# EAGLE design cdf-teensy-interrupter-v2 (EAGLE 7.3.0)
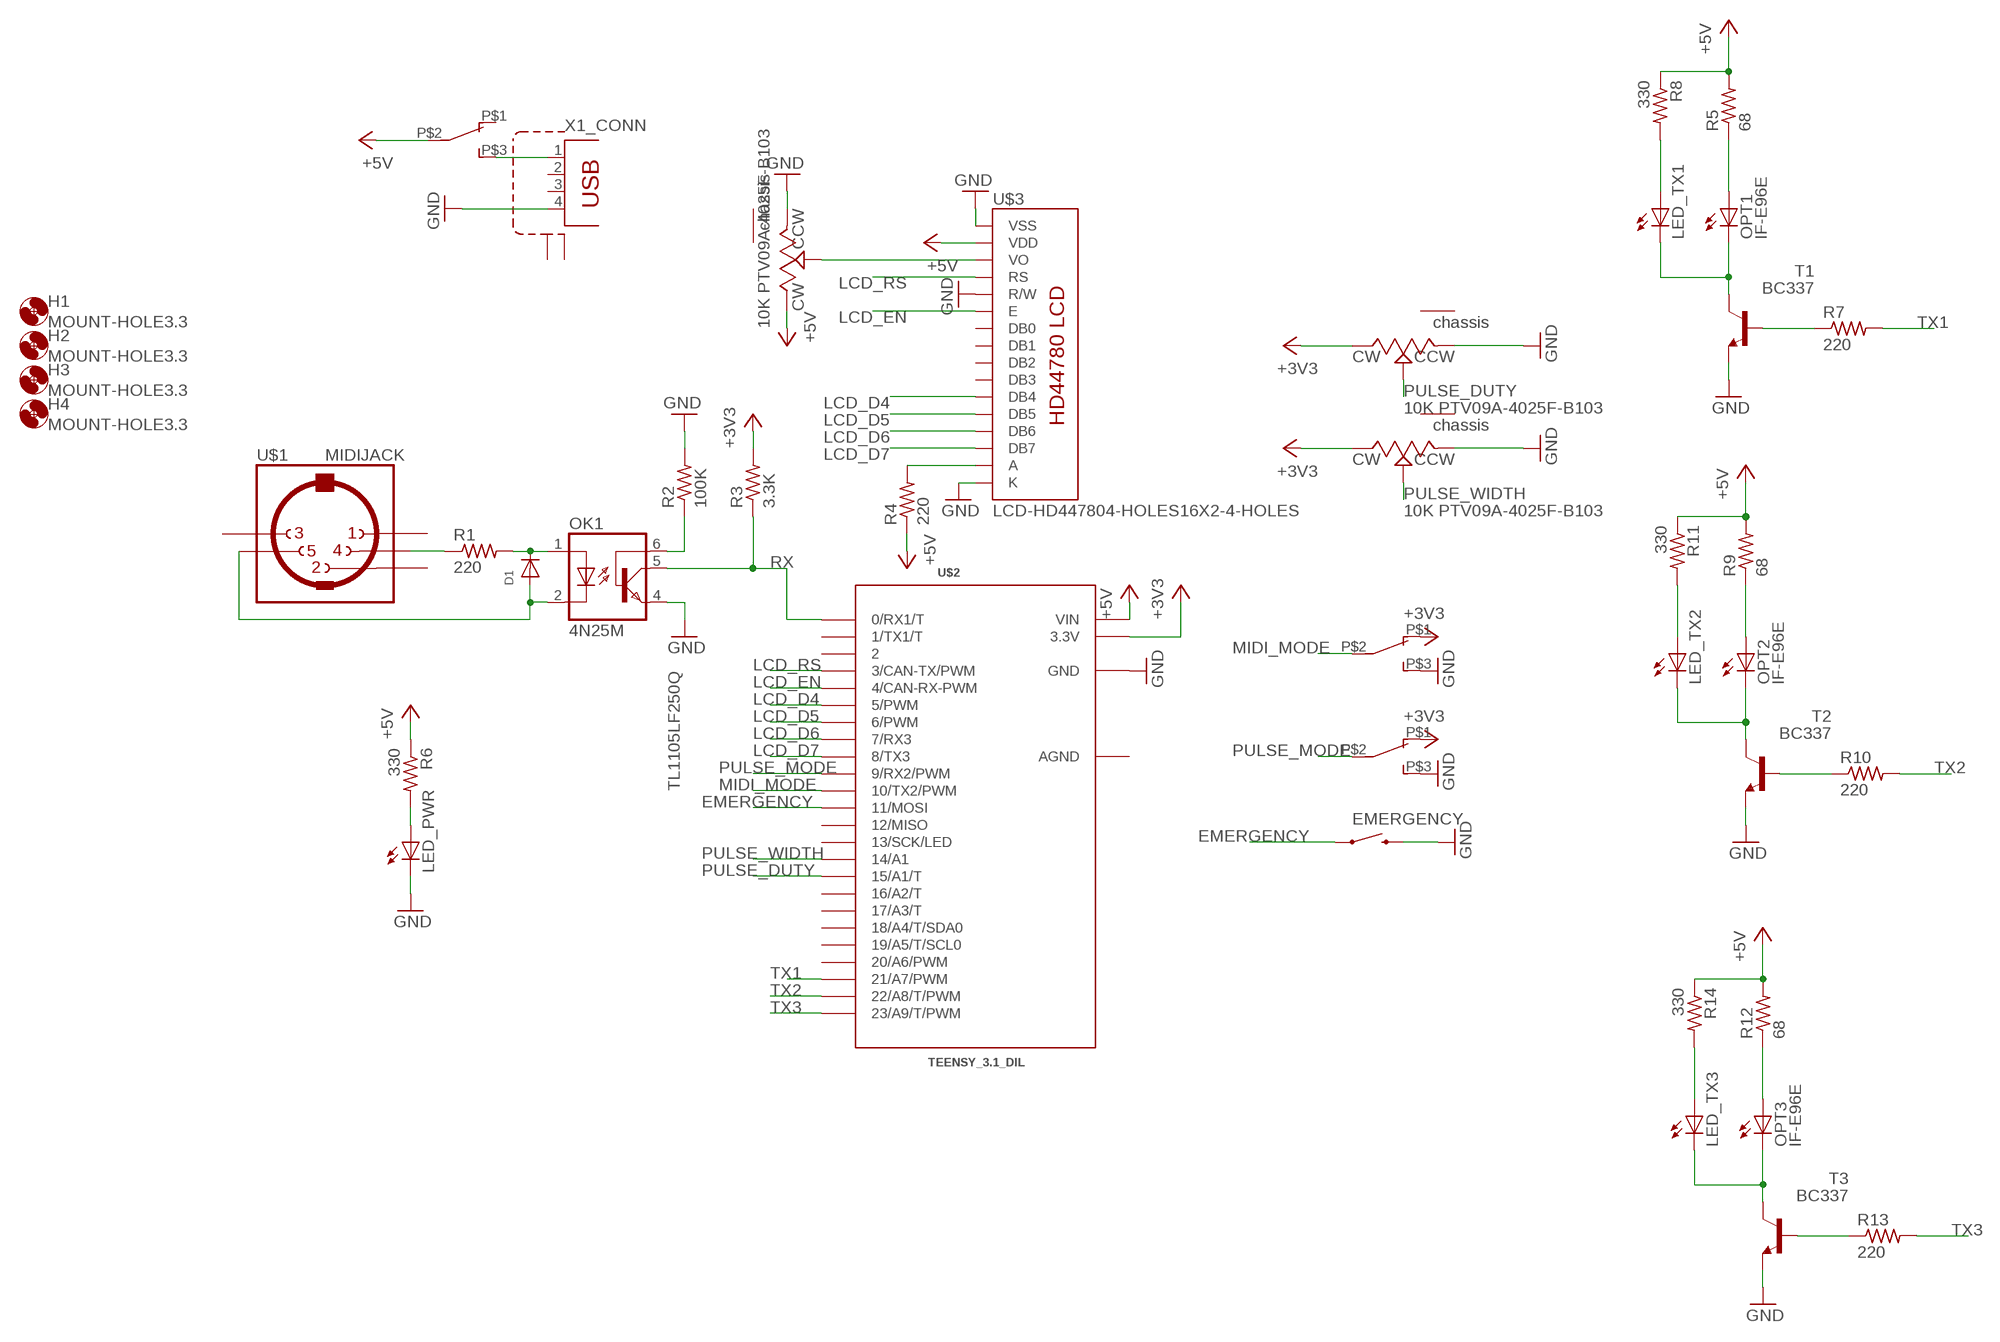
[diagram p0: schematic, sheet 1]

## Parts
D1  DIODEDO-1N4148  [DO-1N4148]
EMERGENCY  TL1105LF250Q  SWITCH-MOMENTARY-2PTH  [TACTILE-PTH]
H1  MOUNT-HOLE3.3  [3,3]
H2  MOUNT-HOLE3.3  [3,3]
H3  MOUNT-HOLE3.3  [3,3]
H4  MOUNT-HOLE3.3  [3,3]
LCD_BL  10K PTV09A-4025F-B103  POTENTIOMETERPTV09A_VERTICAL  [PTV09A-4]
LED_PWR  LED5MM  [LED5MM]
LED_TX1  LED5MM  [LED5MM]
LED_TX2  LED5MM  [LED5MM]
LED_TX3  LED5MM  [LED5MM]
MIDI  100SP1T1B4M2QE  [100SP1T1B4M2QE]
OK1  4N25M  [DIL06]
OPT1  IF-E96E  [IF-E96E]
OPT2  IF-E96E  [IF-E96E]
OPT3  IF-E96E  [IF-E96E]
PULSE  100SP1T1B4M2QE  [100SP1T1B4M2QE]
PULSE_DUTY  10K PTV09A-4025F-B103  POTENTIOMETERPTV09A_VERTICAL  [PTV09A-4]
PULSE_WIDTH  10K PTV09A-4025F-B103  POTENTIOMETERPTV09A_VERTICAL  [PTV09A-4]
PWR_SW  100SP1T1B4M2QE  [100SP1T1B4M2QE]
R1  220  R-US_0204/7  [0204/7]
R2  100K  R-US_0204/7  [0204/7]
R3  3.3K  R-US_0204/7  [0204/7]
R4  220  R-US_0204/7  [0204/7]
R5  68  R-US_0204/7  [0204/7]
R6  330  R-US_0204/7  [0204/7]
R7  220  R-US_0204/7  [0204/7]
R8  330  R-US_0204/7  [0204/7]
R9  68  R-US_0204/7  [0204/7]
R10  220  R-US_0204/7  [0204/7]
R11  330  R-US_0204/7  [0204/7]
R12  68  R-US_0204/7  [0204/7]
R13  220  R-US_0204/7  [0204/7]
R14  330  R-US_0204/7  [0204/7]
T1  BC337  [TO92]
T2  BC337  [TO92]
T3  BC337  [TO92]
U$1  MIDIJACK  [CP-2350]
U$2  TEENSY_3.1_DIL  [TEENSY3-DIL]
U$3  LCD-HD447804-HOLES16X2-4-HOLES  [LCD-16X2-4HOLES]
X1  TE-292304-1  [TE-292304-1]

## Nets
+3V3: MIDI.P$1 PULSE.P$1 PULSE_DUTY.3(CW) PULSE_WIDTH.3(CW) R3.2 U$2.3.3V
+5V: LCD_BL.3(CW) PWR_SW.P$2 R4.1 R5.2 R6.1 R8.1 R9.2 R11.1 R12.2 R14.1 U$2.VIN U$3.2(VDD)
EMERGENCY: EMERGENCY.1 U$2.11(11/MOSI)
GND: EMERGENCY.3 LCD_BL.1(CCW) LED_PWR.K(C) MIDI.P$3 OK1.4(EMI) PULSE.P$3 PULSE_DUTY.1(CCW) PULSE_WIDTH.1(CCW) R2.2 T1.1(E) T2.1(E) T3.1(E) U$2.GND U$3.1(VSS) U$3.5(R/W) U$3.16(K) X1.4
LCD_D4: U$2.5(5/PWM) U$3.11(DB4)
LCD_D5: U$2.6(6/PWM) U$3.12(DB5)
LCD_D6: U$2.7(7/RX3) U$3.13(DB6)
LCD_D7: U$2.8(8/TX3) U$3.14(DB7)
LCD_EN: U$2.4(4/CAN-RX-PWM) U$3.6(E)
LCD_RS: U$2.3(3/CAN-TX/PWM) U$3.4(RS)
MIDI_MODE: MIDI.P$2 U$2.10(10/TX2/PWM)
N$1: R1.1 U$1.4
N$2: D1.C OK1.1(A) R1.2
N$3: D1.A OK1.2(C) U$1.5
N$4: OK1.6(BAS) R2.1
N$5: LCD_BL.2(WIPER) U$3.3(VO)
N$6: R4.2 U$3.15(A)
N$7: R7.1 T1.2(B)
N$8: OPT1.P$2_ANODE+(A) R5.1
N$9: LED_PWR.A R6.2
N$10: LED_TX1.A R8.2
N$11: LED_TX1.K(C) OPT1.P$1_CATHODE-(C) T1.3(C)
N$12: OPT2.P$2_ANODE+(A) R9.1
N$13: R10.1 T2.2(B)
N$14: LED_TX2.K(C) OPT2.P$1_CATHODE-(C) T2.3(C)
N$15: LED_TX2.A R11.2
N$16: OPT3.P$2_ANODE+(A) R12.1
N$17: R13.1 T3.2(B)
N$18: LED_TX3.K(C) OPT3.P$1_CATHODE-(C) T3.3(C)
N$19: LED_TX3.A R14.2
N$20: PWR_SW.P$3 X1.1
PULSE_DUTY: PULSE_DUTY.2(WIPER) U$2.15/A1(15/A1/T)
PULSE_MODE: PULSE.P$2 U$2.9(9/RX2/PWM)
PULSE_WIDTH: PULSE_WIDTH.2(WIPER) U$2.14/A0(14/A1)
RX: OK1.5(COL) R3.1 U$2.0(0/RX1/T)
TX1: R7.2 U$2.21/A7(21/A7/PWM)
TX2: R10.2 U$2.22/A8(22/A8/T/PWM)
TX3: R13.2 U$2.23/A9(23/A9/T/PWM)
Unconnected: LCD_BL.4(CHASSIS) PULSE_DUTY.4(CHASSIS) PULSE_WIDTH.4(CHASSIS) PWR_SW.P$1 U$1.1 U$1.2 U$1.3 U$2.1(1/TX1/T) U$2.2 U$2.12(12/MISO) U$2.13(13/SCK/LED) U$2.16/A2(16/A2/T) U$2.17/A3(17/A3/T) U$2.18/A4(18/A4/T/SDA0) U$2.19/A5(19/A5/T/SCL0) U$2.20/A6(20/A6/PWM) U$3.7(DB0) U$3.8(DB1) U$3.9(DB2) U$3.10(DB3) X1.2 X1.3 X1.P$1(SHIELD:S1) X1.P$2(SHIELD:S2)

## Notes on the sheet
- TL1105LF250Q

## Power pins joined to a net without a drawn wire
AGND: U$2.AGND

## Library data of the parts
D1 = adafruit:DIODE: Diode SMADIODE - SMA Surface Mount Package 20V 1A Schottky Diode Digikey: 641-1014-6-ND DO-1N4148 - Through Hole Small Current Diode SOD-123 20V 1 A (.5mV Vf) Schottky Diode - Digikey: MBRX120TPMSCT-ND SOD-323 10V 570mA (.38mV Vf, 3ns) Schottky Diode - Digikey: ZLLS410CT-ND SOD-523 30V 30mA Schottky Diode (RB751S-40TE61) - Digikey: RB751S-40TE61CT-ND SOT23-R/W - SOT23 Package (R = Solder Paste/Reflow Ovens, W = Hand-Soldering) BAT54Film 40V 300mA - Digikey: 497-7162-1-ND
EMERGENCY = SparkFun-Electromechanical:SWITCH-MOMENTARY-2: Various NO switches- pushbuttons, reed, etc; PROD_ID: SWCH-08441
H1-H4 = holes:MOUNT-HOLE: MOUNTING HOLE with drill center marker
LCD_BL PULSE_DUTY PULSE_WIDTH = Bourns:POTENTIOMETER
LED_PWR LED_TX1-LED_TX3 = adafruit:LED: LED OSRAM: - CHIPLED LG R971, LG N971, LY N971, LG Q971, LY Q971, LO R971, LY R971 LH N974, LH R974 LS Q976, LO Q976, LY Q976 LO Q996 - Hyper CHIPLED LW Q18S LB Q993, LB Q99A, LB R99A - SideLED LS A670, LO A670, LY A670, LG A670, LP A670 LB A673, LV A673, LT A673, LW A673 LH A674 LY A675 LS A676, LA A676, LO A676, LY A676, LW A676 LS A679, LY A679, LG A679 - Hyper Micro SIDELED® LS Y876, LA Y876, LO Y876, LY Y876 LT Y87S - SmartLED LW L88C, LW L88S LB L89C, LB L89S, LG L890 LS L89K, LO L89K, LY L89K LS L896, LA L896, LO L896, LY L896 - TOPLED LS T670, LO T670, LY T670, LG T670, LP T670 LSG T670, LSP T670, LSY T670, LOP T670, LYG T670 LG T671, LOG T671, LSG T671 LB T673, LV T673, LT T673, LW T673 LH T674 LS T676, LA T676, LO T676, LY T676, LB T676, LH T676, LSB T676, LW T676 LB T67C, LV T67C, LT T67C, LS T67K, LO T67K, LY T67K, LW E67C LS E67B, LA E67B, LO E67B, LY E67B, LB E67C, LV E67C, LT E67C LW T67C LS T679, LY T679, LG T679 LS T770, LO T770, LY T770, LG T770, LP T770 LB T773, LV T773, LT T773, LW T773 LH T774 LS E675, LA E675, LY E675, LS T675 LS T776, LA T776, LO T776, LY T776, LB T776 LHGB T686 LT T68C, LB T68C - Hyper Mini TOPLED® LB M676 - Mini TOPLED Santana® LG M470 LS M47K, LO M47K, LY M47K Source: http://www.osram.convergy.de/
MIDI PULSE PWR_SW = keves:100SP1T1B4M2QE: 100SP1T1B4M2QE SPDT SWITCH
OK1 = optocoupler:4N*?M: General Purpose 6-Pin Phototransistor Optocouplers Source: http://www.fairchildsemi.com/ds/4N/4N35-M.pdf; MPN: 4N25-M; OC_FARNELL: 1021349; OC_NEWARK: 98K9084
OPT1-OPT3 = keves:IF-E96E
R1-R14 = rcl:R-US_: RESISTOR, American symbol
T1-T3 = transistor:BC337: NPN TRANSISTOR
U$1 = keves:MIDIJACK: DIN 5 jack also known as MIDI jack A modification of conn-hirshman:MAB5SH with two options for the grounding 'teeth'
U$2 = Teensy_3_and_LC_Series_Boards_v1.1:TEENSY_3.1_DIL: Teensy 3.1 or 3.2 in a DIL Layout.
U$3 = HD44780LCD:LCD-HD44780
X1 = keves:TE-292304-1: USB A Female connector; MPN: 292304-1

## Board
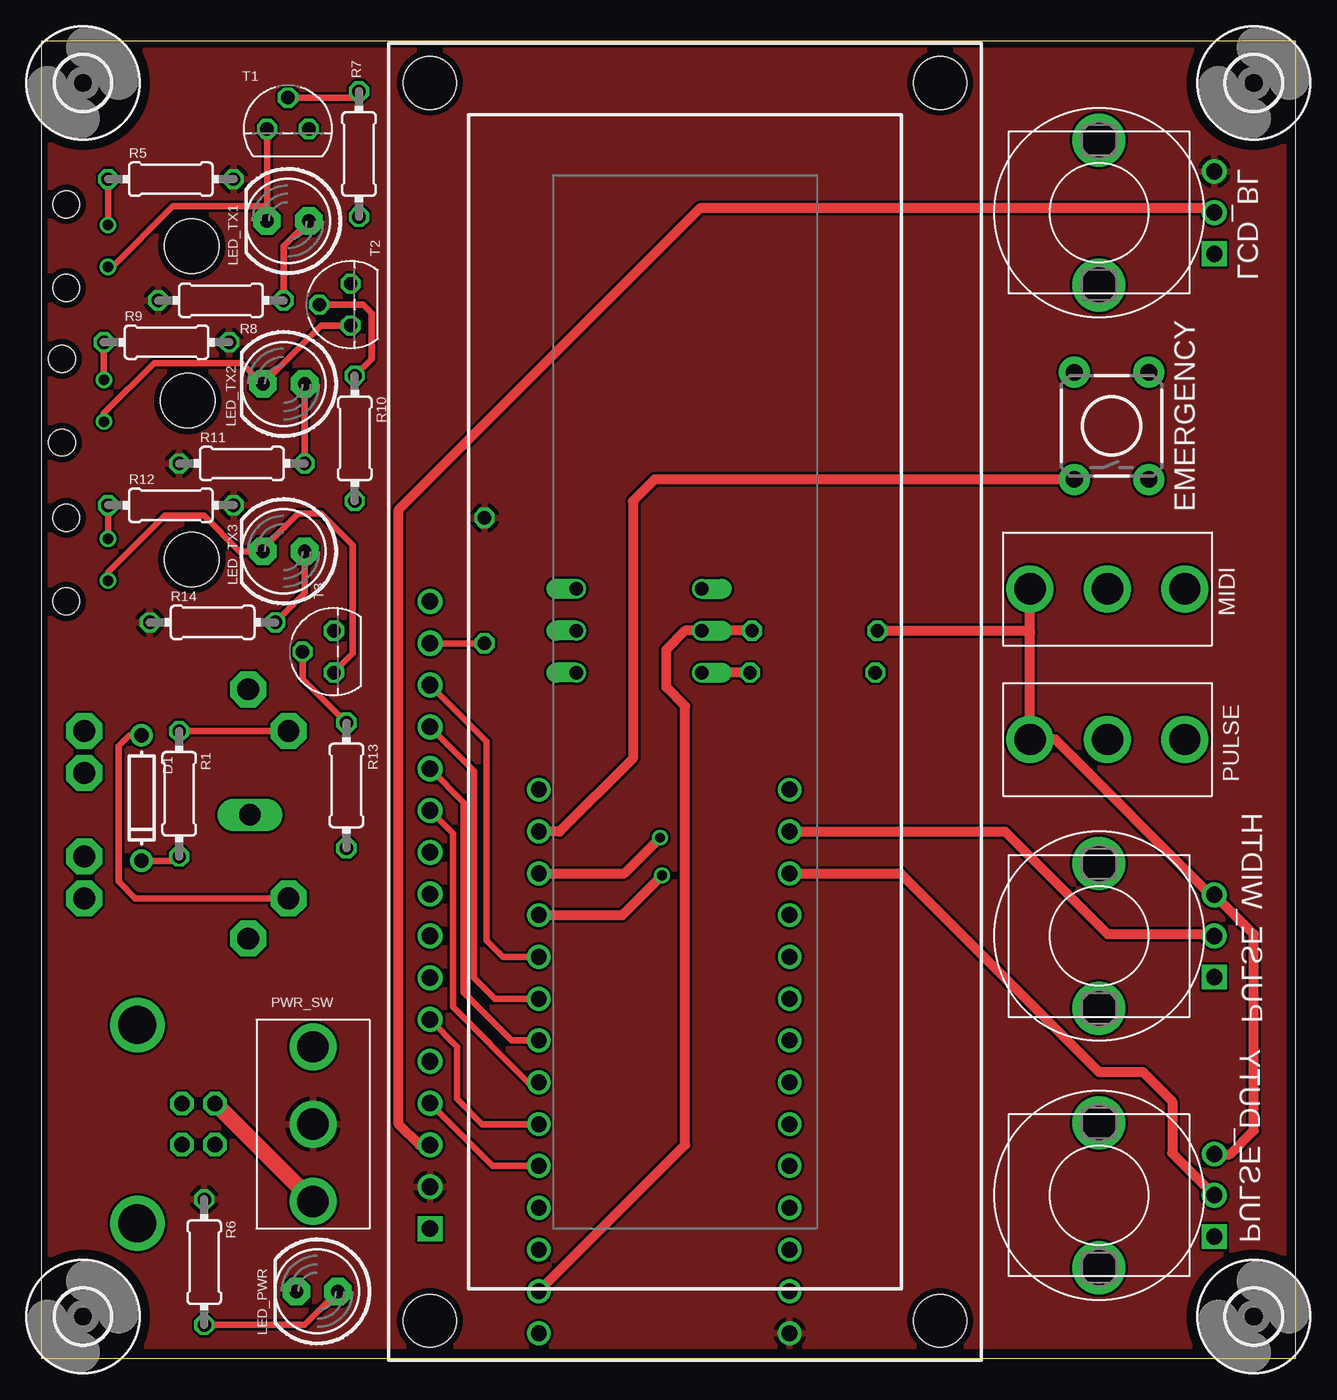
[diagram p1: board, top side]
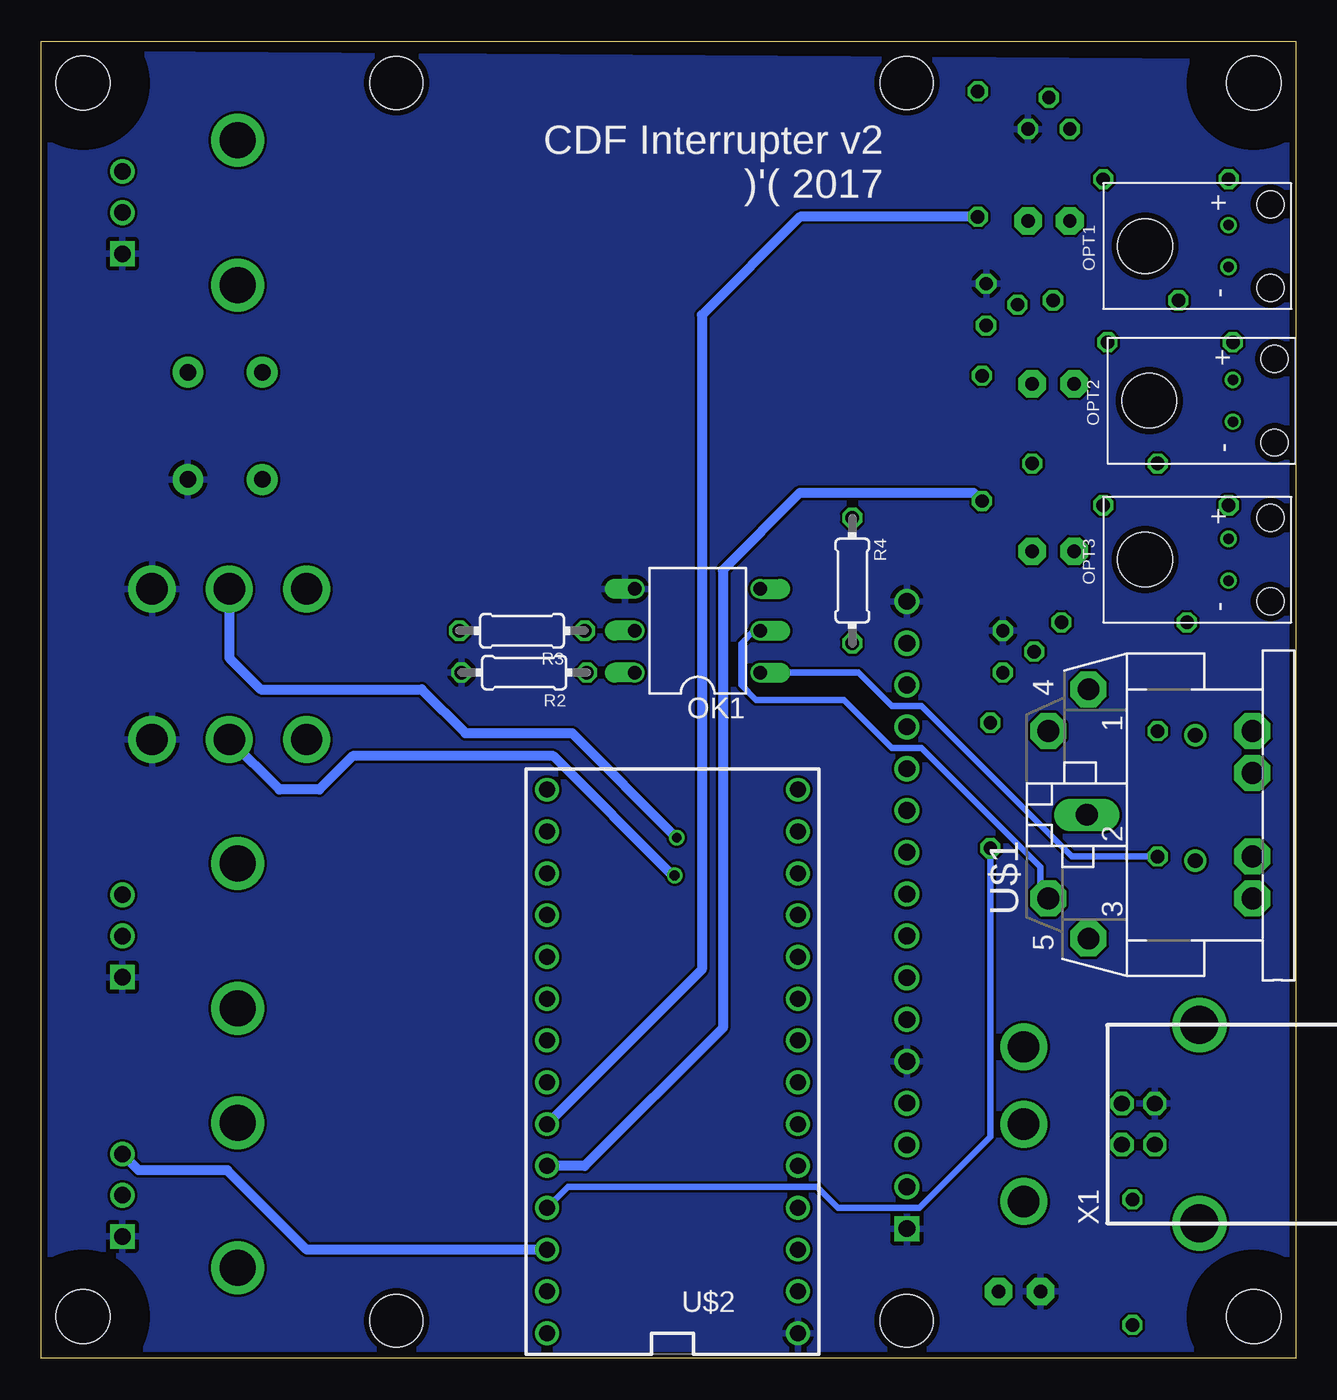
[diagram p2: board, bottom side, seen from below]

Size 76.2 x 80.01 mm. Coordinates in mm from the lower left corner, seen from the top.
Outline: 76.2,80.01 0,80.01 0,0 76.2,0 76.2,80.01
Copper layers (1*16): Top 0.0356mm / dielectric 1.5011mm / Bottom 0.0356mm
Design rules "oshpark *": minimum track width 6mil, minimum drill 13mil, track to track 6mil, track to pad 6mil, pad to pad 6mil, via to via 6mil, smd to smd 6mil, copper to edge 15mil, drill to drill 6mil, minimum pad ring 7mil, minimum via ring 7mil, stop-mask expansion 3mil, vias tented up to drill 0mil, thermal gap 10mil

### Footprints (pad centres in the part's own frame; a part is rotated, then mirrored left to right if it is on the bottom)
DO-1N4148 = drill 0.9: A -3.81,0; C 3.81,0
TACTILE-PTH = drill 1.016 pad 1.88: 1 -3.251,2.261; 2 3.251,2.261; 3 -3.251,-2.261; 4 3.251,-2.261
3,3 = hole 3.3: 0,0
PTV09A-4 = drill 1 square: 1 -2.5,-7 | drill 1: 2 0,-7; 3 2.5,-7 | drill 2.2: 4 -4.4,0; 5 4.4,0
LED5MM = drill 0.813 pad 1.676 octagon: A -1.27,0; K 1.27,0
100SP1T1B4M2QE = drill 1.905: P$1 -4.699,0; P$2 0,0; P$3 4.699,0
DIL06 = drill 0.813 offset: 1 -2.54,-3.81; 2 0,-3.81; 3 2.54,-3.81; 4 2.54,3.81; 5 0,3.81; 6 -2.54,3.81
IF-E96E = drill 0.635: P$1_CATHODE- 1.27,-2.54; P$2_ANODE+ -1.27,-2.54 | hole 3.302: 0,-7.62 | hole 1.626: 2.54,0; -2.54,0
0204/7 = drill 0.813 octagon: 1 -3.81,0; 2 3.81,0
TO92 = drill 0.813 octagon: 1 1.27,0; 2 0,1.905; 3 -1.27,0
CP-2350 = drill 1.321 pad 2.184 octagon: 1 7.62,12.58; 3 -7.52,12.58; 4 5.08,15.02; 5 -5.08,15.02; PE -2.54,2.62; PE1 -5.08,2.62; PE2 5.08,2.62; PE@ 2.54,2.62 | drill 1.321 long: 2 0,12.68
TEENSY3-DIL = drill 0.965: 0 -7.62,13.97; 1 -7.62,11.43; 2 -7.62,8.89; 3 -7.62,6.35; 3.3V 7.62,11.43; 4 -7.62,3.81; 5 -7.62,1.27; 6 -7.62,-1.27; 7 -7.62,-3.81; 8 -7.62,-6.35; 9 -7.62,-8.89; 10 -7.62,-11.43; 11 -7.62,-13.97; 12 -7.62,-16.51; 13 7.62,-16.51; 14/A0 7.62,-13.97; 15/A1 7.62,-11.43; 16/A2 7.62,-8.89; 17/A3 7.62,-6.35; 18/A4 7.62,-3.81; 19/A5 7.62,-1.27; 20/A6 7.62,1.27; 21/A7 7.62,3.81; 22/A8 7.62,6.35; 23/A9 7.62,8.89; AGND 7.62,13.97; GND -7.62,16.51; VIN 7.62,16.51
LCD-16X2-4HOLES = drill 1.016 square: 1 -32,15.5 | drill 1.016: 2 -29.46,15.5; 3 -26.92,15.5; 4 -24.38,15.5; 5 -21.84,15.5; 6 -19.3,15.5; 7 -16.76,15.5; 8 -14.22,15.5; 9 -11.68,15.5; 10 -9.14,15.5; 11 -6.6,15.5; 12 -4.06,15.5; 13 -1.52,15.5; 14 1.02,15.5; 15 3.56,15.5; 16 6.1,15.5 | hole 3.2: -37.6,15.5; -37.6,-15.5; 37.6,-15.5; 37.6,15.5
TE-292304-1 = drill 0.95 octagon: 1 1.25,4.71; 2 -1.25,4.71; 3 -1.25,2.71; 4 1.25,2.71 | drill 2.3: P$1 6.02,0; P$2 -6.02,0

### Placement (x,y rotation side)
D1  6.1,34.04 270 top
EMERGENCY  65.02,56.64 90 top
H1  73.66,77.47 180 top
H2  73.66,2.54 180 top
H3  2.54,77.47 180 top
H4  2.54,2.54 180 top
LCD_BL  64.26,69.6 90 top
LED_PWR  16.76,4.06 180 top
LED_TX1  14.99,69.09 180 top
LED_TX2  14.73,59.18 180 top
LED_TX3  14.73,49.02 180 top
MIDI  64.77,46.74 0 top
OK1  36.32,44.2 90 bottom
OPT1  1.52,67.56 270 bottom
OPT2  1.27,58.17 270 bottom
OPT3  1.52,48.51 270 bottom
PULSE  64.77,37.59 0 top
PULSE_DUTY  64.26,9.91 90 top
PULSE_WIDTH  64.26,25.65 90 top
PWR_SW  16.51,14.22 270 top
R1  8.38,34.29 270 top
R2  46.86,41.66 180 bottom
R3  46.99,44.2 180 bottom
R4  26.92,47.24 270 bottom
R5  7.87,71.63 0 top
R6  9.91,5.84 270 top
R7  19.3,73.15 270 top
R8  10.92,64.26 0 top
R9  7.62,61.72 0 top
R10  19.05,55.88 270 top
R11  12.19,54.36 0 top
R12  7.87,51.82 0 top
R13  18.54,34.8 270 top
R14  10.41,44.7 0 top
T1  14.99,74.68 0 top
T2  18.8,64.01 90 top
T3  17.78,42.93 90 top
U$1  0,33.02 90 bottom
U$2  37.85,18.03 180 bottom
U$3  39.12,39.88 90 top
X1  5.84,14.22 90 bottom

### Tracks (layer width: path | path; a pad name or v marks a point on that pad's centre or on a via)
+3V3
  Top 0.61: 71.09,12.57 PULSE_DUTY.3 72.22,12.41 73.66,13.84 73.66,25.76 PULSE_WIDTH.3 71.03,28.15 61.59,37.59 PULSE.P$1 60.07,44.07 | 60.07,44.07 MIDI.P$1 | R3.2 59.94,44.2 60.07,44.07
  Bottom 0.61: U$2.3.3V 60.07,6.6 64.9,11.43 70.29,11.43 PULSE_DUTY.3
+5V
  pour Top: 75.44,79.5 0.51,79.5 0.51,0.76 75.44,0.76
EMERGENCY
  Top 0.61: EMERGENCY.1 37.26,53.39 35.94,52.07 35.94,36.45 31.5,32 U$2.11
GND
  pour Bottom: 75.69,79.25 0.51,78.74 0.51,0 75.69,0.51
LCD_D4
  Top 0.406: U$2.5 29.59,16.76 25.02,21.34 25.02,31.88 U$3.11
LCD_D5
  Top 0.406: U$2.6 28.57,19.3 25.65,22.23 25.65,33.78 U$3.12
LCD_D6
  Top 0.406: U$2.7 27.56,21.84 26.29,23.11 26.29,35.69 U$3.13
LCD_D7
  Top 0.406: U$2.8 28.07,24.38 27.05,25.4 27.05,37.46 U$3.14
LCD_EN
  Top 0.406: U$2.4 26.8,14.22 25.27,15.75 25.27,18.92 U$3.6
LCD_RS
  Top 0.406: U$2.3 27.43,11.68 U$3.4
MIDI_MODE  (via drill 0.6)
  Top 0.61: U$2.10 35.43,29.46 v37.59,31.62
  Bottom 0.61: MIDI.P$2 64.77,42.55 62.87,40.64 53.09,40.64 50.42,37.97 43.94,37.97 v37.59,31.62
N$1
  Top 0.406: R1.1 U$1.4
N$2
  Top 0.406: D1.C 8.13,30.23 R1.2
  Bottom 0.406: OK1.1 26.54,41.66 24.51,39.62 22.73,39.62 13.59,30.48 R1.2
N$3
  Top 0.406: D1.A 5.33,37.85 4.7,37.21 4.7,28.96 5.71,27.94 U$1.5
  Bottom 0.406: OK1.2 32.89,44.2 33.66,43.43 33.66,40.89 32.77,40.01 27.43,40.01 24.51,37.08 22.73,37.08 15.49,29.84 15.49,28.41 U$1.5
N$4
  Top 0.61: R2.1 OK1.6
N$5
  Top 0.61: U$3.3 22.98,12.96 21.72,14.22 21.72,51.56 40.01,69.85 71.01,69.85 LCD_BL.2
N$6
  Top 0.406: R4.2 U$3.15
N$7
  Top 0.406: T1.2 18.92,76.58 R7.1
N$8
  Top 0.406: OPT1.P$2_ANODE+ R5.1
N$9
  Top 0.406: R6.2 16,2.03 LED_PWR.A
N$10
  Top 0.406: R8.2 14.73,67.56 LED_TX1.A
N$11
  Top 0.406: T1.3 13.72,70.1 | 13.72,70.1 LED_TX1.K | OPT1.P$1_CATHODE- 4.32,66.29 8,69.98 13.59,69.98 13.72,70.1
N$12
  Top 0.406: OPT2.P$2_ANODE+ R9.1
N$13
  Top 0.406: T2.2 19.56,64.01 20.07,63.5 20.07,60.71 R10.1
N$14
  Top 0.406: T2.3 17.02,62.74 LED_TX2.K 12.19,60.45 6.86,60.45 3.81,57.4 OPT2.P$1_CATHODE-
N$15
  Top 0.406: LED_TX2.A R11.2
N$16
  Top 0.406: OPT3.P$2_ANODE+ R12.1
N$17
  Top 0.406: T3.2 15.88,41.27 R13.1
N$18
  Top 0.406: T3.3 18.92,42.8 18.92,49.4 17.02,51.31 15.62,51.31 13.46,49.15 LED_TX3.K 12.06,49.02 9.91,51.18 7.49,51.18 4.06,47.75 OPT3.P$1_CATHODE-
N$19
  Top 0.406: LED_TX3.A 16,46.48 R14.2
N$20
  Top 1.016: X1.1 PWR_SW.P$3
PULSE_DUTY
  Top 0.61: U$2.15/A1 52.2,29.46 64.26,17.4 66.93,17.4 68.71,15.62 68.71,12.46 PULSE_DUTY.2
PULSE_MODE  (via drill 0.6)
  Top 0.61: U$2.9 35.31,26.92 v37.72,29.34
  Bottom 0.61: PULSE.P$2 61.72,34.54 59.31,34.54 57.28,36.58 45.09,36.58 37.85,29.34 v37.72,29.34
PULSE_WIDTH
  Top 0.61: U$2.14/A0 58.55,32 64.77,25.78 71.14,25.78 PULSE_WIDTH.2
RX
  Top 0.61: R3.1 OK1.5 39.12,44.2 37.97,43.05 37.97,40.77 39.12,39.62 39.12,12.95 U$2.0
TX1
  Bottom 0.61: R7.2 30.1,69.34 36.07,63.37 36.07,23.62 U$2.21/A7
TX2
  Bottom 0.61: U$2.22/A8 43.18,11.68 34.8,20.07 34.8,47.88 30.1,52.58 19.56,52.58 R10.2
TX3
  Bottom 0.406: R13.2 18.54,13.46 22.86,9.14 27.81,9.14 29.08,10.41 44.2,10.41 U$2.23/A9

### Text on the board
bPlace: CDF Interrupter v2 / )'( 2017